# Altium project EDGAR_00.PrjPcb
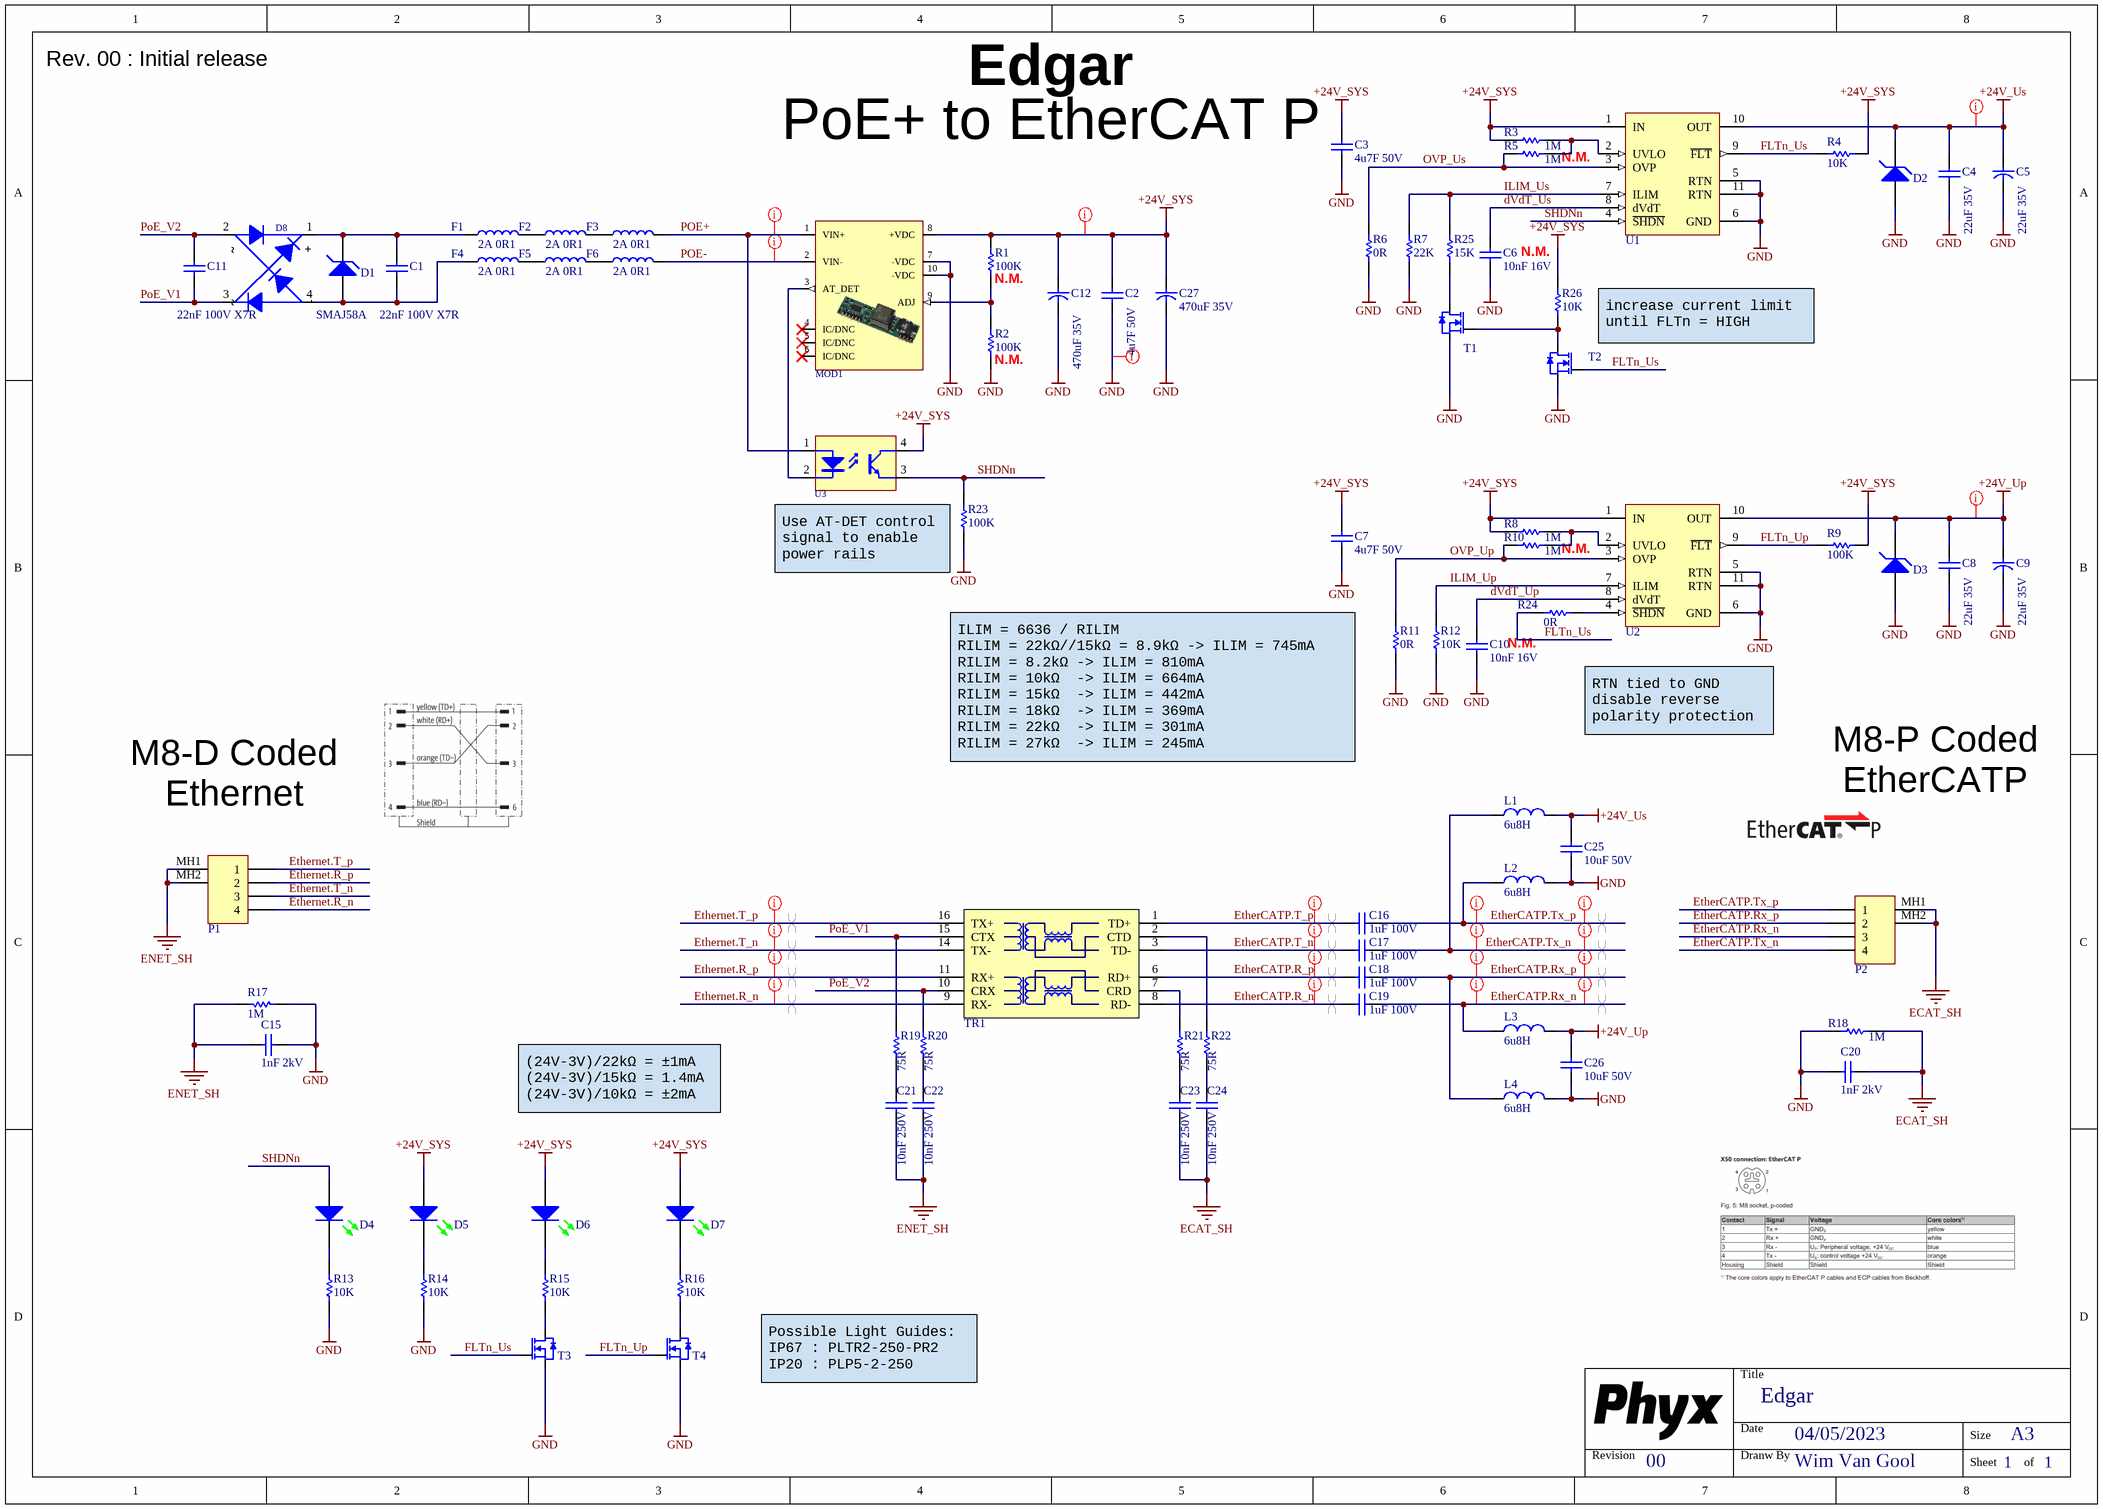
[diagram p0: EDGAR_00.SchDoc]
PCB_ENGINEER: WimVG; PCB_REV: 00; PCB_TITLE: Edgar
1 sheet, 80 parts. Net scope: global (net labels, ports and power ports of the same name join across sheets).
Board file: EDGAR_00.PcbDoc

## Sheet EDGAR_00.SchDoc: Edgar
size A3; Date: 04/05/2023; DrawnBy: Wim Van Gool; DocumentNumber: 1; Revision: 00; SheetNumber: 1; SheetTotal: 1

### Parts
C1  value 22nF 100V X7R  [C0603_N]  (hidden comment: CAP_CERAMIC)
C2  value 4u7F 50V  [C1210_N]  (hidden comment: CAP_CERAMIC)
C3  value 4u7F 50V  [C1210_N]  (hidden comment: CAP_CERAMIC)
C4  value 22uF 35V  [C1206_N]  (hidden comment: CAP_CERAMIC)
C5  value 22uF 35V  [C6.6x5.4]  (hidden comment: CAP_POL)
C6  value 10nF 16V  [C0603_N]  (hidden comment: CAP_CERAMIC)
C7  value 4u7F 50V  [C1210_N]  (hidden comment: CAP_CERAMIC)
C8  value 22uF 35V  [C1206_N]  (hidden comment: CAP_CERAMIC)
C9  value 22uF 35V  [C6.6x5.4]  (hidden comment: CAP_POL)
C10  value 10nF 16V  [C0603_N]  (hidden comment: CAP_CERAMIC)
C11  value 22nF 100V X7R  [C0603_N]  (hidden comment: CAP_CERAMIC)
C12  value 470uF 35V  [C10x10.2]  (hidden comment: CAP_POL)
C15  value 1nF 2kV  [C1206_N]  (hidden comment: CAP_CERAMIC)
C16  value 1uF 100V  [C1206_N]  (hidden comment: CAP_CERAMIC)
C17  value 1uF 100V  [C1206_N]  (hidden comment: CAP_CERAMIC)
C18  value 1uF 100V  [C1206_N]  (hidden comment: CAP_CERAMIC)
C19  value 1uF 100V  [C1206_N]  (hidden comment: CAP_CERAMIC)
C20  value 1nF 2kV  [C1206_N]  (hidden comment: CAP_CERAMIC)
C21  value 10nF 250V  [C1206_N]  (hidden comment: CAP_CERAMIC)
C22  value 10nF 250V  [C1206_N]  (hidden comment: CAP_CERAMIC)
C23  value 10nF 250V  [C1206_N]  (hidden comment: CAP_CERAMIC)
C24  value 10nF 250V  [C1206_N]  (hidden comment: CAP_CERAMIC)
C25  value 10uF 50V  [C1206_N]  (hidden comment: CAP_CERAMIC)
C26  value 10uF 50V  [C1206_N]  (hidden comment: CAP_CERAMIC)
C27  value 470uF 35V  [C_12.5x14_5mm]  (hidden comment: URZ1V471MHD)
D1  value SMAJ58A  [SMA_AC]  (hidden comment: TVS Diode 58V 400W Unidirectional DO-214AC SMA)
D2  TVS Diode 24V 400W Unidirectional DO-214AC SMA  [SMA_AC]  (value not drawn)
D3  TVS Diode 24V 400W Unidirectional DO-214AC SMA  [SMA_AC]  (value not drawn)
D4  Default 0805 Green LED  [LED_0805_GR]  (value not drawn)
D5  Default 0805 Green LED  [LED_0805_GR]  (value not drawn)
D6  Default 0805 Green LED  [LED_0805_GR]  (value not drawn)
D7  Default 0805 Green LED  [LED_0805_GR]  (value not drawn)
D8  Bridge Rectifier 100V 2A CD-HD201  [BRNS_CD_HD2x]  (value not drawn)
F1  value 2A 0R1  [L0805]  (hidden comment: FERRITE)
F2  value 2A 0R1  [L0805]  (hidden comment: FERRITE)
F3  value 2A 0R1  [L0805]  (hidden comment: FERRITE)
F4  value 2A 0R1  [L0805]  (hidden comment: FERRITE)
F5  value 2A 0R1  [L0805]  (hidden comment: FERRITE)
F6  value 2A 0R1  [L0805]  (hidden comment: FERRITE)
L1  value 6u8H  [WE_WE-LHMI_5020]  (hidden comment: 74437334068)
L2  value 6u8H  [WE_WE-LHMI_5020]  (hidden comment: 74437334068)
L3  value 6u8H  [WE_WE-LHMI_5020]  (hidden comment: 74437334068)
L4  value 6u8H  [WE_WE-LHMI_5020]  (hidden comment: 74437334068)
MOD1  PoE+ Module 24V 30W 802.3at Silvertel Ag5424  [SIL_Ag5400]  (value not drawn)
P1  Receptacle, M8, female, straight, 4 poles, D-coded, back wall-mounting, print contact, shielded, Industrial Ethernet  [ESCHA_8089337]  (value not drawn)
P2  Receptacle, M8, female, straight, 4 poles, P-coded, back wall-mounting, print contact, shielded, EtherCATP  [ESCHA_8089341]  (value not drawn)
R1  value 100K  [R0603_N]  (hidden comment: RESISTOR)
R2  value 100K  [R0603_N]  (hidden comment: RESISTOR)
R3  value 1M  [R0603_N]  (hidden comment: RESISTOR)
R4  value 10K  [R0603_N]  (hidden comment: RESISTOR)
R5  value 1M  [R0603_N]  (hidden comment: RESISTOR)
R6  value 0R  [R0603_N]  (hidden comment: RESISTOR)
R7  value 22K  [R0603_N]  (hidden comment: RESISTOR)
R8  value 1M  [R0603_N]  (hidden comment: RESISTOR)
R9  value 100K  [R0603_N]  (hidden comment: RESISTOR)
R10  value 1M  [R0603_N]  (hidden comment: RESISTOR)
R11  value 0R  [R0603_N]  (hidden comment: RESISTOR)
R12  value 10K  [R0603_N]  (hidden comment: RESISTOR)
R13  value 10K  [R0603_N]  (hidden comment: RESISTOR)
R14  value 10K  [R0603_N]  (hidden comment: RESISTOR)
R15  value 10K  [R0603_N]  (hidden comment: RESISTOR)
R16  value 10K  [R0603_N]  (hidden comment: RESISTOR)
R17  value 1M  [R0603_N]  (hidden comment: RESISTOR)
R18  value 1M  [R0603_N]  (hidden comment: RESISTOR)
R19  value 75R  [R0603_N]  (hidden comment: RESISTOR)
R20  value 75R  [R0603_N]  (hidden comment: RESISTOR)
R21  value 75R  [R0603_N]  (hidden comment: RESISTOR)
R22  value 75R  [R0603_N]  (hidden comment: RESISTOR)
R23  value 100K  [R0603_N]  (hidden comment: RESISTOR)
R24  value 0R  [R0603_N]  (hidden comment: RESISTOR)
R25  value 15K  [R0603_N]  (hidden comment: RESISTOR)
R26  value 10K  [R0603_N]  (hidden comment: RESISTOR)
T1  0.12A N-Ch MOSFET 60V Vgs 2.5  [SOT23-3]  (value not drawn)
T2  0.12A N-Ch MOSFET 60V Vgs 2.5  [SOT23-3]  (value not drawn)
T3  0.12A N-Ch MOSFET 60V Vgs 2.5  [SOT23-3]  (value not drawn)
T4  0.12A N-Ch MOSFET 60V Vgs 2.5  [SOT23-3]  (value not drawn)
TR1  10/100 Ethernet transformer with720mA PoE  [WE_749012310]  (value not drawn)
U1  4.5-V to 60-V, 478mΩ, 0.025-0.88A eFuse, auto retry, input and output reverse polarity protection  [TI_DRC10]  (value not drawn)
U2  4.5-V to 60-V, 478mΩ, 0.025-0.88A eFuse, auto retry, input and output reverse polarity protection  [TI_DRC10]  (value not drawn)
U3  CTR 50~600, 35V Vce, 60mA, 3.75kV  [WE_WL-OCPT_SOP-4]  (value not drawn)

### Nets
+24V_SYS: C2.1 C3.1 C7.1 C12.1 C27.1 D5.1(A) D6.1(A) D7.1(A) MOD1.8(+VDC) R1.1 R3.2 R4.1 R8.2 R9.1 R26.1 U1.1(IN) U2.1(IN) U3.4(C)
+24V_Up: C8.1 C9.1 C26.1 D3.C L3.2 U2.10(OUT)
+24V_Us: C4.1 C5.1 C25.1 D2.C L1.2 U1.10(OUT)
ECAT_SH: C20.1 C23.2 C24.2 P2.MH1 P2.MH2 R18.1
ENET_SH: C15.1 C21.2 C22.2 P1.MH1 P1.MH2 R17.1
GND: C2.2 C3.2 C4.2 C5.2 C6.2 C7.2 C8.2 C9.2 C10.2 C12.2 C15.2 C20.2 C25.2 C26.2 C27.2 D2.A D3.A L2.2 L4.2 MOD1.7(-VDC) MOD1.10(-VDC) R2.2 R6.2 R7.2 R11.2 R12.2 R13.2 R14.2 R17.2 R18.2 R23.2 T1.2(S) T2.2(S) T3.2(S) T4.2(S) U1.5(RTN) U1.6(GND) U1.11(RTN) U2.5(RTN) U2.6(GND) U2.11(RTN)
dVdT_Up: C10.1 U2.8(dVdT)
dVdT_Us: C6.1 U1.8(dVdT)
EtherCATP.R_n: C19.2 TR1.8(RD-)
EtherCATP.R_p: C18.2 TR1.6(RD+)
EtherCATP.Rx_n: C19.1 L3.1 P2.3
EtherCATP.Rx_p: C18.1 L4.1 P2.2
EtherCATP.T_n: C17.2 TR1.3(TD-)
EtherCATP.T_p: C16.2 TR1.1(TD+)
EtherCATP.Tx_n: C17.1 L1.1 P2.4
EtherCATP.Tx_p: C16.1 L2.1 P2.1
Ethernet.R_n: P1.4 TR1.9(RX-)
Ethernet.R_p: P1.2 TR1.11(RX+)
Ethernet.T_n: P1.3 TR1.14(TX-)
Ethernet.T_p: P1.1 TR1.16(TX+)
FLTn_Up: R9.2 T4.1(G) U2.9(~{FLT})
FLTn_Us: R4.2 R24.1 T2.1(G) T3.1(G) U1.9(~{FLT})
ILIM_Up: R12.1 U2.7(ILIM)
ILIM_Us: R7.1 R25.1 U1.7(ILIM)
OVP_Up: R10.2 R11.1 U2.3(OVP)
OVP_Us: R5.2 R6.1 U1.3(OVP)
POE+: F3.2 MOD1.1(VIN+) U3.1(A)
POE-: F6.2 MOD1.2(VIN-)
PoE_V1: C11.2 D8.3(C) R19.1 TR1.15(CTX)
PoE_V2: C11.1 D8.2(A) R20.1 TR1.10(CRX)
SHDNn: D4.1(A) R23.1 U1.4(~{SHDN}) U3.3(E)
NetC1_1: C1.1 D1.C D8.1(C) F1.1
NetC1_2: C1.2 D1.A D8.4(A) F4.1
NetC21_1: C21.1 R19.2
NetC22_1: C22.1 R20.2
NetC23_1: C23.1 R21.2
NetC24_1: C24.1 R22.2
NetD4_2: D4.2(K) R13.1
NetD5_2: D5.2(K) R14.1
NetD6_2: D6.2(K) R15.1
NetD7_2: D7.2(K) R16.1
NetF1_2: F1.2 F2.1
NetF2_2: F2.2 F3.1
NetF4_2: F4.2 F5.1
NetF5_2: F5.2 F6.1
NetMOD1_3: MOD1.3(AT_DET) U3.2(K)
NetMOD1_9: MOD1.9(ADJ) R1.2 R2.1
NetR3_1: R3.1 R5.1 U1.2(UVLO)
NetR8_1: R8.1 R10.1 U2.2(UVLO)
NetR15_2: R15.2 T3.3(D)
NetR16_2: R16.2 T4.3(D)
NetR21_1: R21.1 TR1.7(CRD)
NetR22_1: R22.1 TR1.2(CTD)
NetR24_2: R24.2 U2.4(~{SHDN})
NetR25_2: R25.2 T1.3(D)
NetR26_2: R26.2 T1.1(G) T2.3(D)

Not connected (* = marked no-connect by the designer): MOD1 4(IC/DNC)* 5(IC/DNC)* 6(IC/DNC)*

### Layout directives
differential pair; differential pair class EtherCATP: EtherCATP.Rx_n, EtherCATP.Rx_p, EtherCATP.Tx_n, EtherCATP.Tx_p
net class 100R: EtherCATP.R_n, EtherCATP.R_p, EtherCATP.Rx_n, EtherCATP.Rx_p, EtherCATP.T_n, EtherCATP.T_p, EtherCATP.Tx_n, EtherCATP.Tx_p, Ethernet.R_n, Ethernet.R_p, Ethernet.T_n, Ethernet.T_p
differential pair; net class EtherCATP_c: EtherCATP.R_n, EtherCATP.R_p, EtherCATP.T_n, EtherCATP.T_p
net class EtherCATP: EtherCATP.Rx_n, EtherCATP.Rx_p, EtherCATP.Tx_n, EtherCATP.Tx_p
differential pair; differential pair class 10/100; net class Fe: Ethernet.R_n, Ethernet.R_p, Ethernet.T_n, Ethernet.T_p
net class POWER: +24V_SYS, +24V_Up, +24V_Us, GND, POE+, POE-

### Notes on the sheet
- Rev. 00 : Initial release
- (near C3) PoE+ to EtherCAT P
- N.M.
- (near R1) N.M.
- (near R2) N.M.
- increase current limit until FLTn = HIGH
- (near R23) Use AT-DET control signal to enable power rails
- M8-D Coded
- (near R11) ILIM = 6636 / RILIM
  RILIM = 22kΩ//15kΩ = 8.9kΩ -> ILIM = 745mA
  RILIM = 8.2kΩ -> ILIM = 810mA
  RILIM = 10kΩ  -> ILIM = 664mA
  RILIM = 15kΩ  -> ILIM = 442mA
  RILIM = 18kΩ  -> ILIM = 369mA
  RILIM = 22kΩ  -> ILIM = 301mA
  RILIM = 27kΩ  -> ILIM = 245mA
- RTN tied to GND disable reverse polarity protection
- M8-P Coded
- Ethernet
- EtherCATP
- (24V-3V)/22kΩ = ±1mA
  (24V-3V)/15kΩ = 1.4mA
  (24V-3V)/10kΩ = ±2mA
- Possible Light Guides:
  IP67 : PLTR2-250-PR2
  IP20 : PLP5-2-250
- Title
- Revision
- Date
- Dranw By
- Size
- A3
- Sheet
- of
- (in symbol BRIDGE # CD-HD201) +; ~; -

### Library data of the parts
C1 C11 = CAP # 22nF 100V 0603 X7R: Capacitor Ceramic; Supplier 1: Farnell; Supplier Part Number 1: 2346911; Supplier 2: Farnell; Supplier Part Number 2: 3581381
C2 C3 C7 = CAP # 4u7F 50V 1210 X7R: Capacitor Ceramic; Supplier 1: Farnell; Supplier Part Number 1: 1828841
C4 C8 = CAP # 22uF 35V 1206 X5R: Capacitor Ceramic; Supplier 1: Digi-key; Supplier Part Number 1: 445-8045-1-ND; Supplier 3: Generic; Supplier Part Number 3: 22uF 35V 1206 X7R
C5 C9 = CAP # 22uF 35V 6mm3: Capacitor electrolyt; Supplier 1: Farnell; Supplier Part Number 1: 9265724; Supplier 3: Generic; Supplier Part Number 3: 22uF 35V 6.6x X7R
C6 C10 = CAP # 10nF 16V 0603: Capacitor Ceramic; Supplier 3: Generic; Supplier Part Number 3: 10nF 16V 0603 X7R
C12 = CAP # 470uF 35V 10mm: Capacitor electrolyt; Supplier 1: Digi-key; Supplier Part Number 1: P122430CT-ND
C15 C20 = CAP # 1nF 2kV 1206: Capacitor Ceramic
C16-C19 = CAP # 1uF 100V 1206: Capacitor Ceramic; Supplier 1: Farnell; Supplier Part Number 1: 1735543; Supplier 2: Farnell; Supplier Part Number 2: 2666590; Supplier 3: Generic; Supplier Part Number 3: 1uF 100V 1206 X7R
C21-C24 = CAP # 10nF 250V 1206: Capacitor Ceramic; Supplier 1: Farnell; Supplier Part Number 1: 2852359; Supplier 3: Generic; Supplier Part Number 3: 10nF 250V 1206 X7R
C25 C26 = CAP # 10uF 50V 1206: Capacitor Ceramic; Supplier 1: Farnell; Supplier Part Number 1: 2382682; Supplier 3: Generic; Supplier Part Number 3: 10uF 50V 1206 X7R
C27 = CAP 470uF 35V 12.5x14mm: Capacitor electrolyt; Supplier 1: Digi-key; Supplier Part Number 1: 493-15958-ND
D1 = TVS # UNI 58V SMAJ58A: SMAJ58A; Supplier 1: Farnell; Supplier Part Number 1: 1579005
D2 D3 = TVS # UNI 24V SMAJ24A: =Description; Value: SMAJ24A; Supplier 1: Farnell; Supplier Part Number 1: 2675296
D4-D7 = LED # Green 0805: =Description; Supplier 1: Farnell; Supplier Part Number 1: 2099239
D8 = BRIDGE # CD-HD201: =Description; Value: CD-HD201; Supplier 1: Digi-key; Supplier Part Number 1: CD-HD201CT-ND
F1-F6 = FER # 600R 2A 0805 0R10: Supplier 1: Farnell; Supplier Part Number 1: 1838838; Supplier 2: Farnell; Supplier Part Number 2: 2475050; Supplier 3: Farnell; Supplier Part Number 3: 1838838
L1-L4 = IND # 6u8H 5.2x5.2 WE-LHMI 5020: Supplier 1: Digi-key; Supplier Part Number 1: 732-6156-1-ND; Supplier 2: Farnell; Supplier Part Number 2: 2467217; Supplier 3: Mouser; Supplier Part Number 3: 710-74437334068
MOD1 = PWR # MOD PoE 802.3at 30W 24V Ag5424: =Description; Value: Ag5424; Supplier 1: Mouser; Supplier Part Number 1: 480-AG5424
P1 = M8 D IE-FHM8KSD4-P: Value: IE-FHM8KSD4-P/M10
P2 = M8 P IE-FHM8KSP4-P: Value: IE-FHM8KSP4-P/M10
R1 R2 R9 R23 = RES # 100K 0603: Supplier 3: Generic; Supplier Part Number 3: 100K 1% 0603
R3 R5 R8 R10 R17 R18 = RES # 1M 0603: Supplier 3: Generic; Supplier Part Number 3: 1M 1% 0603
R4 R12-R16 R26 = RES # 10K 0603: Supplier 3: Generic; Supplier Part Number 3: 10K 1% 0603; Supplier 1: Farnell; Supplier Part Number 1: 2502397; Supplier 2: LCSC; Supplier Part Number 2: C25804
R6 R11 R24 = RES # 0R 0603: Supplier 3: Generic; Supplier Part Number 3: 0R 1% 0603; Supplier 1: Farnell; Supplier Part Number 1: 2447743; Supplier 2: LCSC; Supplier Part Number 2: C95177
R7 = RES # 22K 0603: Supplier 3: Generic; Supplier Part Number 3: 22K 1% 0603
R19-R22 = RES # 75R 0603: Supplier 3: Generic; Supplier Part Number 3: 75R 1% 0603
R25 = RES # 15K 0603: Supplier 3: Generic; Supplier Part Number 3: 15K 1% 0603
T1-T4 = 2N7002 N-Ch MOSFET 0.12A 2.5Vgs 60Vds SOT23: Value: 2N7002; Supplier 1: Farnell; Supplier Part Number 1: 9845313
TR1 = TR # 749012310 WE-LAN AQ: =Description; Value: 749012310; Supplier 1: Farnell; Supplier Part Number 1: 4066195; Supplier 2: Digi-key; Supplier Part Number 2: 732-749012310CT-ND; Supplier 3: Mouser; Supplier Part Number 3: 710-749012310
U1 U2 = EFUSE # TPS26625 60V 880mA: =Description; Value: TPS26625; Supplier 1: Digi-key; Supplier Part Number 1: 296-52606-1-ND; Supplier 2: Ti; Supplier Part Number 2: TPS26625DRCR
U3 = OPTO # 140357145000: =Description; Value: 140357145000; Supplier 2: Wurth; Supplier Part Number 2: 140357145000

## Assembly variants
Default: not fitted C5 C6 C9 C10 C12 C13 C14 R1 R2 R5 R10